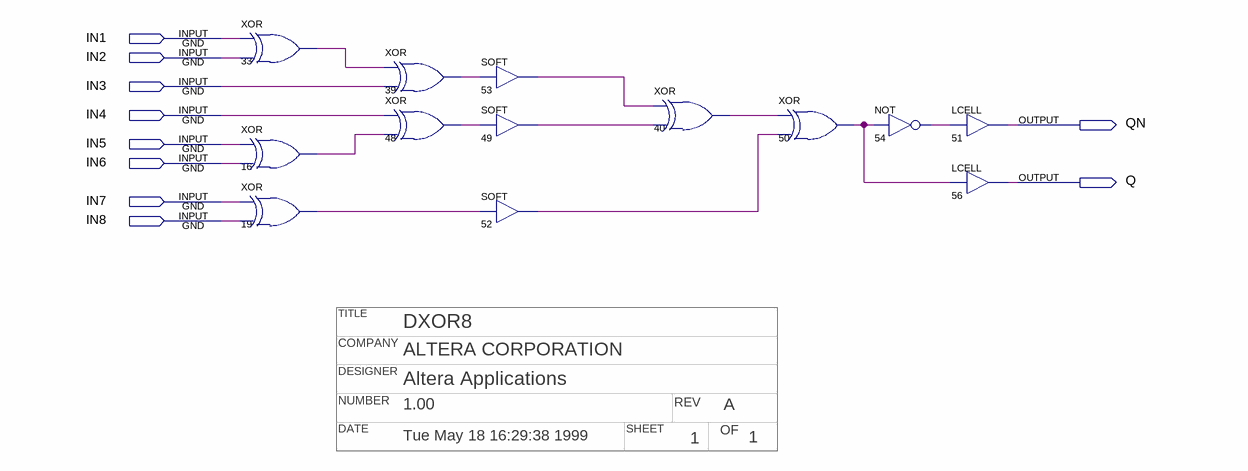
[diagram p0: schematic sheet]
// Quartus schematic dxor8.bdf as structural Verilog: 13 symbols, 10 pins
// Title block: TITLE: DXOR8; COMPANY: ALTERA CORPORATION; DESIGNER: Altera Applications; NUMBER: 1.00; REV: A; DATE: Tue May 18 16:29:38 1999; SHEET: 1; OF: 1
module dxor8 (
  input  IN1,
  input  IN2,
  input  IN3,
  input  IN4,
  input  IN5,
  input  IN6,
  input  IN7,
  input  IN8,
  output QN,
  output Q
);

  wire n16_out, n19_out, n33_out, n39_out, n40_out, n48_out, n49_out, n50_out, n52_out, n53_out, n54_out;

  xor u_33 (n33_out, IN1, IN2);
  xor u_16 (n16_out, IN5, IN6);
  xor u_19 (n19_out, IN7, IN8);
  xor u_39 (n39_out, n33_out, IN3);
  xor u_48 (n48_out, IN4, n16_out);
  SOFT u_53 (.IN(n39_out), .OUT(n53_out));
  SOFT u_49 (.IN(n48_out), .OUT(n49_out));
  SOFT u_52 (.IN(n19_out), .OUT(n52_out));
  xor u_40 (n40_out, n53_out, n49_out);
  xor u_50 (n50_out, n40_out, n52_out);
  not u_54 (n54_out, n50_out);
  LCELL u_51 (.IN(n54_out), .OUT(QN));
  LCELL u_56 (.IN(n50_out), .OUT(Q));
endmodule
